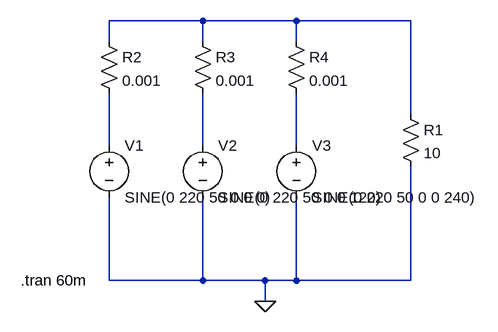
[diagram p0: schematic 3phaseRload.asc]
3phaseRload.asc, the LTspice schematic file:
Version 4
SHEET 1 880 680
WIRE 336 112 192 112
WIRE 480 112 336 112
WIRE 656 112 480 112
WIRE 192 144 192 112
WIRE 336 144 336 112
WIRE 480 144 480 112
WIRE 656 256 656 112
WIRE 192 304 192 224
WIRE 336 304 336 224
WIRE 480 304 480 224
WIRE 192 512 192 384
WIRE 336 512 336 384
WIRE 336 512 192 512
WIRE 432 512 336 512
WIRE 480 512 480 384
WIRE 480 512 432 512
WIRE 656 512 656 336
WIRE 656 512 480 512
WIRE 432 544 432 512
FLAG 432 544 0
SYMBOL voltage 192 288 R0
SYMATTR InstName V1
SYMATTR Value SINE(0 220 50 0 0 0)
SYMBOL voltage 336 288 R0
SYMATTR InstName V2
SYMATTR Value SINE(0 220 50 0 0 120)
SYMBOL voltage 480 288 R0
SYMATTR InstName V3
SYMATTR Value SINE(0 220 50 0 0 240)
SYMBOL res 640 240 R0
SYMATTR InstName R1
SYMATTR Value 10
SYMBOL res 176 128 R0
SYMATTR InstName R2
SYMATTR Value 0.001
SYMBOL res 320 128 R0
SYMATTR InstName R3
SYMATTR Value 0.001
SYMBOL res 464 128 R0
SYMATTR InstName R4
SYMATTR Value 0.001
TEXT 56 512 Left 2 !.tran 60m

The netlist it stands for:
* 3phaseRload.asc
V1 N002 0 SINE(0 220 50 0 0 0)
V2 N003 0 SINE(0 220 50 0 0 120)
V3 N004 0 SINE(0 220 50 0 0 240)
R1 N001 0 10
R2 N001 N002 0.001
R3 N001 N003 0.001
R4 N001 N004 0.001
.tran 60m
.backanno
.end